# Altium schematic sheet showroom_v1_schematic.SchDoc
size A3
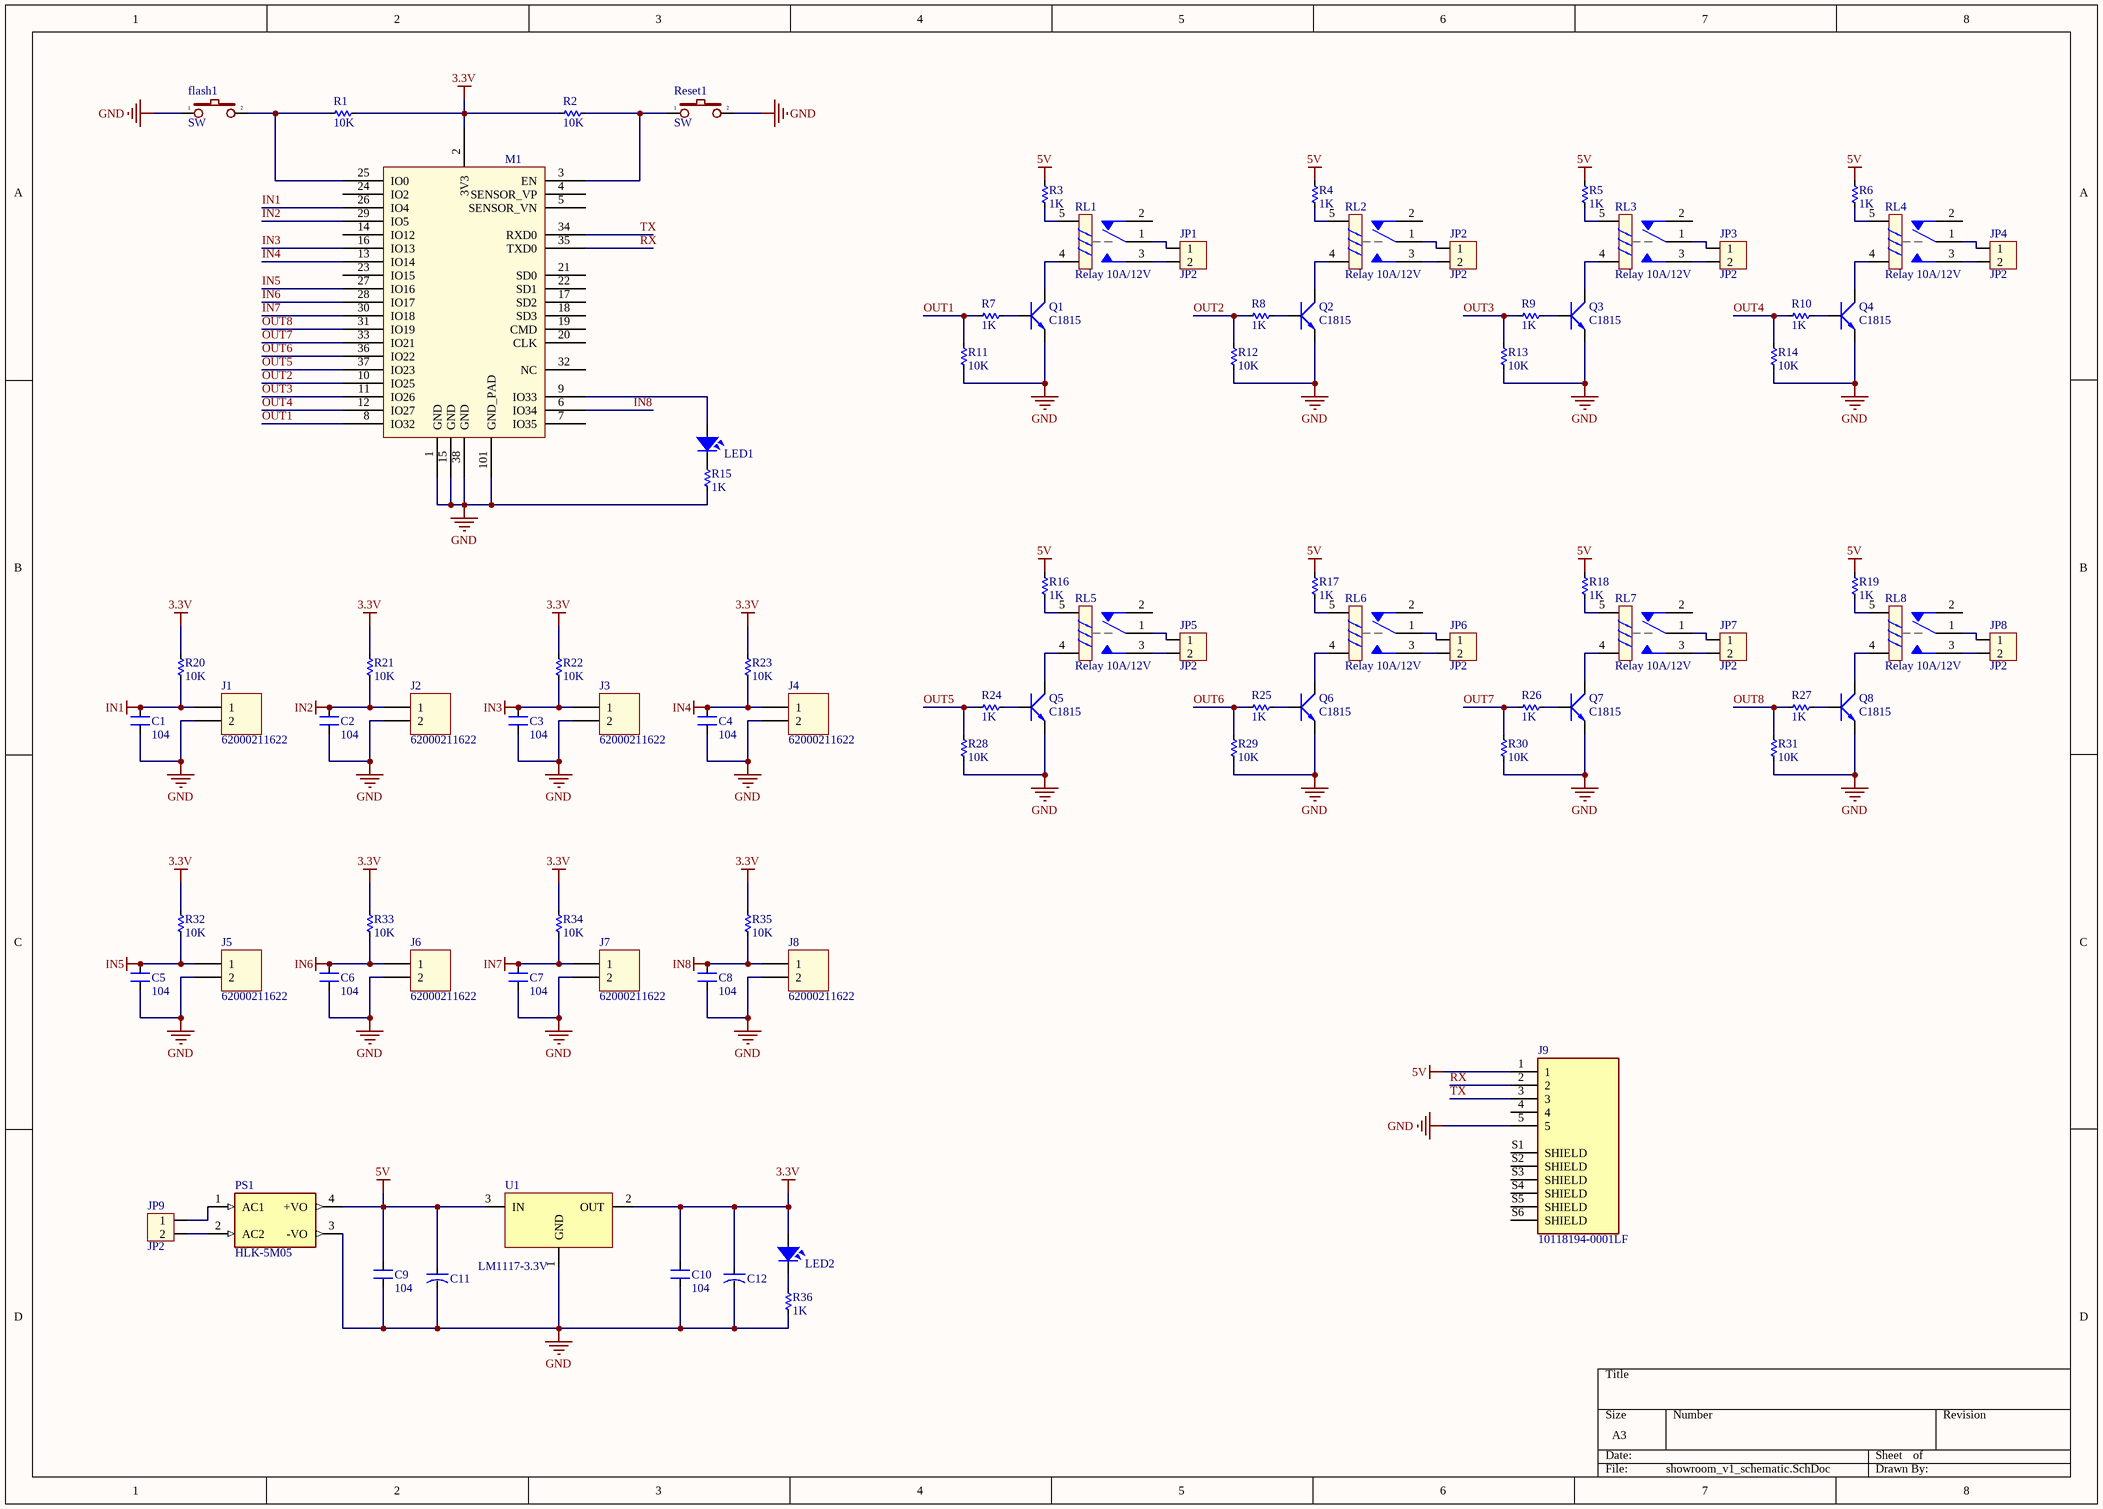
[diagram p0: showroom_v1_schematic.SchDoc]

## Parts
C1  104  [SM-CAP-0805]
C2  104  [SM-CAP-0805]
C3  104  [SM-CAP-0805]
C4  104  [SM-CAP-0805]
C5  104  [SM-CAP-0805]
C6  104  [SM-CAP-0805]
C7  104  [SM-CAP-0805]
C8  104  [SM-CAP-0805]
C9  104  [SM-CAP-0805]
C10  104  [SM-CAP-0805]
C11  CN-ALU-SMD  [CAP-ALU-SMD-4.5x5x1.4]  (value not drawn)
C12  CN-ALU-SMD  [CAP-ALU-SMD-4.5x5x1.4]  (value not drawn)
flash1  SW  [SW-DIP1]
J1  62000211622  [62000211622]
J2  62000211622  [62000211622]
J3  62000211622  [62000211622]
J4  62000211622  [62000211622]
J5  62000211622  [62000211622]
J6  62000211622  [62000211622]
J7  62000211622  [62000211622]
J8  62000211622  [62000211622]
J9  10118194-0001LF  [AMPHENOL_10118194-0001LF]
JP1  JP2  [CON 2/7.62mm]
JP2  JP2  [CON 2/7.62mm]
JP3  JP2  [CON 2/7.62mm]
JP4  JP2  [CON 2/7.62mm]
JP5  JP2  [CON 2/7.62mm]
JP6  JP2  [CON 2/7.62mm]
JP7  JP2  [CON 2/7.62mm]
JP8  JP2  [CON 2/7.62mm]
JP9  JP2  [CON 2/7.62mm]
LED1  LED  [LED-0805-Blue]  (value not drawn)
LED2  LED  [LED-0805-Blue]  (value not drawn)
M1  ESP32S_Module  [ESP32S]  (value not drawn)
PS1  HLK-5M05  [CONV_HLK-5M05]
Q1  C1815  [SOT23B]
Q2  C1815  [SOT23B]
Q3  C1815  [SOT23B]
Q4  C1815  [SOT23B]
Q5  C1815  [SOT23B]
Q6  C1815  [SOT23B]
Q7  C1815  [SOT23B]
Q8  C1815  [SOT23B]
R1  10K  [RES-SMD-0805]
R2  10K  [RES-SMD-0805]
R3  1K  [RES-SMD-0805]
R4  1K  [RES-SMD-0805]
R5  1K  [RES-SMD-0805]
R6  1K  [RES-SMD-0805]
R7  1K  [RES-SMD-0805]
R8  1K  [RES-SMD-0805]
R9  1K  [RES-SMD-0805]
R10  1K  [RES-SMD-0805]
R11  10K  [RES-SMD-0805]
R12  10K  [RES-SMD-0805]
R13  10K  [RES-SMD-0805]
R14  10K  [RES-SMD-0805]
R15  1K  [RES-SMD-0805]
R16  1K  [RES-SMD-0805]
R17  1K  [RES-SMD-0805]
R18  1K  [RES-SMD-0805]
R19  1K  [RES-SMD-0805]
R20  10K  [RES-SMD-0805]
R21  10K  [RES-SMD-0805]
R22  10K  [RES-SMD-0805]
R23  10K  [RES-SMD-0805]
R24  1K  [RES-SMD-0805]
R25  1K  [RES-SMD-0805]
R26  1K  [RES-SMD-0805]
R27  1K  [RES-SMD-0805]
R28  10K  [RES-SMD-0805]
R29  10K  [RES-SMD-0805]
R30  10K  [RES-SMD-0805]
R31  10K  [RES-SMD-0805]
R32  10K  [RES-SMD-0805]
R33  10K  [RES-SMD-0805]
R34  10K  [RES-SMD-0805]
R35  10K  [RES-SMD-0805]
R36  1K  [RES-SMD-0805]
Reset1  SW  [SW1-SMD]
RL1  Relay 10A/12V  [RELAY 5]
RL2  Relay 10A/12V  [RELAY 5]
RL3  Relay 10A/12V  [RELAY 5]
RL4  Relay 10A/12V  [RELAY 5]
RL5  Relay 10A/12V  [RELAY 5]
RL6  Relay 10A/12V  [RELAY 5]
RL7  Relay 10A/12V  [RELAY 5]
RL8  Relay 10A/12V  [RELAY 5]
U1  LM1117-3.3V  [SOT223]

## Nets
3.3V: C10.2 C12.1 LED2.1 M1.2(3V3) R1.2 R2.1 R20.2 R21.2 R22.2 R23.2 R32.2 R33.2 R34.2 R35.2 U1.2(OUT)
5V: C9.2 C11.1 J9.1 PS1.4(+VO) R3.2 R4.2 R5.2 R6.2 R16.2 R17.2 R18.2 R19.2 U1.3(IN)
GND: C1.1 C2.1 C3.1 C4.1 C5.1 C6.1 C7.1 C8.1 C9.1 C10.1 C11.2 C12.2 flash1.1 J1.2 J2.2 J3.2 J4.2 J5.2 J6.2 J7.2 J8.2 J9.5 M1.1(GND) M1.15(GND) M1.38(GND) M1.101(GND_PAD) PS1.3(-VO) Q1.1(E) Q2.1(E) Q3.1(E) Q4.1(E) Q5.1(E) Q6.1(E) Q7.1(E) Q8.1(E) R11.1 R12.1 R13.1 R14.1 R15.1 R28.1 R29.1 R30.1 R31.1 R36.2 Reset1.2 U1.1(GND)
IN1: C1.2 J1.1 M1.26(IO4) R20.1
IN2: C2.2 J2.1 M1.29(IO5) R21.1
IN3: C3.2 J3.1 M1.16(IO13) R22.1
IN4: C4.2 J4.1 M1.13(IO14) R23.1
IN5: C5.2 J5.1 M1.27(IO16) R32.1
IN6: C6.2 J6.1 M1.28(IO17) R33.1
IN7: C7.2 J7.1 M1.30(IO18) R34.1
IN8: C8.2 J8.1 M1.6(IO34) R35.1
OUT1: M1.8(IO32) R7.1 R11.2
OUT2: M1.10(IO25) R8.1 R12.2
OUT3: M1.11(IO26) R9.1 R13.2
OUT4: M1.12(IO27) R10.1 R14.2
OUT5: M1.37(IO23) R24.1 R28.2
OUT6: M1.36(IO22) R25.1 R29.2
OUT7: M1.33(IO21) R26.1 R30.2
OUT8: M1.31(IO19) R27.1 R31.2
RX: J9.2 M1.35(TXD0)
TX: J9.3 M1.34(RXD0)
Netflash1_2: flash1.2 M1.25(IO0) R1.1
NetJP1_1: JP1.1 RL1.1
NetJP1_2: JP1.2 RL1.3
NetJP2_1: JP2.1 RL2.1
NetJP2_2: JP2.2 RL2.3
NetJP3_1: JP3.1 RL3.1
NetJP3_2: JP3.2 RL3.3
NetJP4_1: JP4.1 RL4.1
NetJP4_2: JP4.2 RL4.3
NetJP5_1: JP5.1 RL5.1
NetJP5_2: JP5.2 RL5.3
NetJP6_1: JP6.1 RL6.1
NetJP6_2: JP6.2 RL6.3
NetJP7_1: JP7.1 RL7.1
NetJP7_2: JP7.2 RL7.3
NetJP8_1: JP8.1 RL8.1
NetJP8_2: JP8.2 RL8.3
NetJP9_1: JP9.1 PS1.1(AC1)
NetJP9_2: JP9.2 PS1.2(AC2)
NetLED1_1: LED1.1 M1.9(IO33)
NetLED1_2: LED1.2 R15.2
NetLED2_2: LED2.2 R36.1
NetM1_3: M1.3(EN) R2.2 Reset1.1
NetQ1_2: Q1.2(C) RL1.4
NetQ1_3: Q1.3(B) R7.2
NetQ2_2: Q2.2(C) RL2.4
NetQ2_3: Q2.3(B) R8.2
NetQ3_2: Q3.2(C) RL3.4
NetQ3_3: Q3.3(B) R9.2
NetQ4_2: Q4.2(C) RL4.4
NetQ4_3: Q4.3(B) R10.2
NetQ5_2: Q5.2(C) RL5.4
NetQ5_3: Q5.3(B) R24.2
NetQ6_2: Q6.2(C) RL6.4
NetQ6_3: Q6.3(B) R25.2
NetQ7_2: Q7.2(C) RL7.4
NetQ7_3: Q7.3(B) R26.2
NetQ8_2: Q8.2(C) RL8.4
NetQ8_3: Q8.3(B) R27.2
NetR3_1: R3.1 RL1.5
NetR4_1: R4.1 RL2.5
NetR5_1: R5.1 RL3.5
NetR6_1: R6.1 RL4.5
NetR16_1: R16.1 RL5.5
NetR17_1: R17.1 RL6.5
NetR18_1: R18.1 RL7.5
NetR19_1: R19.1 RL8.5

Not connected (* = marked no-connect by the designer): J9 4 S1(SHIELD) S2(SHIELD) S3(SHIELD) S4(SHIELD) S5(SHIELD) S6(SHIELD); M1 4(SENSOR_VP) 5(SENSOR_VN) 7(IO35) 14(IO12) 17(SD2) 18(SD3) 19(CMD) 20(CLK) 21(SD0) 22(SD1) 23(IO15) 24(IO2) 32(NC); RL1 2; RL2 2; RL3 2; RL4 2; RL5 2; RL6 2; RL7 2; RL8 2

## Library data of the parts
C1-C10 = CN: Value: 0,1uF/300V; Designed by: VanDungEvn
C11 C12 = CN-ALU-SMD: Polarized Capacitor (Axial); Published: 8-Jun-2000; LatestRevisionDate: 17-Jul-2002; LatestRevisionNote: Re-released for DXP Platform.; PackageReference: POLAR0.8; Publisher: Altium Limited
flash1 Reset1 = SW2: Switch button 2 pin; Value: SW chip 2 pin
J1-J8 = 62000211622: WR-WTB 2.00mm Male Vertical Shrouded Header, 2p; Pin Number: 2; ComponentLink1Description: Manufacturer; ComponentLink1URL: http://www.we-online.de; ComponentLink2Description: Datasheet; ComponentLink2URL: http://katalog.we-online.de/em/datasheet/6200xx11622.pdf; Part Number: 62000211622; Published Date: June 2017; Publisher: Wurth Elektronik; Pitch: 2.00 mm
J9 = 10118194-0001LF: USB - micro B USB 2.0 Receptacle Connector 5 Position Surface Mount, Right Angle; Through Hole; MF: Amphenol ICC; Package: None; Price: None; Availability: Unavailable; MP: 10118194-0001LF; SnapEDA_Link: https://www.snapeda.com/parts/10118194-0001LF/Amphenol%20FCI/view-part/1413308/?ref=snap; Value: *
JP1-JP9 = Con2: Connector 2; Value: Connector 2
LED1 LED2 = LED SMD: Value: LED 3 - 5 ly 2 Colour
M1 = ESP32S_Module: Esp-32S; Datasheet: https://espressif.com/sites/default/files/documentation/esp_wroom_32_datasheet_en.pdf
PS1 = HLK-5M05: AC DC 220V to 5V 5W 5Watt Isolated Switching Step-Down Power Supply Module Converter; MF: Hi-link; Availability: Unavailable; SnapEDA_Link: https://www.snapeda.com/parts/HLK-5M05/Hi-link/view-part/2758659/?ref=snap; Price: None; Package: Package Analog Devices; MP: HLK-5M05; Value: *
Q1-Q8 = C1815: NPN 600mW, ECB; Value: C1815
R1-R36 = Res-SMD: Resistor; Manufacturer: Generic Components; Class: Passive; Published: 08/06/2000; Publisher: Altium Hobart Technology Centre
RL1-RL8 = Relay 5: Relay SPDT,10A - 12VDC 5 Pin; Value: Relay SPDT, 10A, 12V
U1 = LM1117: 800mA Low-Dropout Linear Regulator; Creator: Nguyen Ba Bien; Website: http://group3i.net